# EAGLE design nixie board (EAGLE 9.5.1)
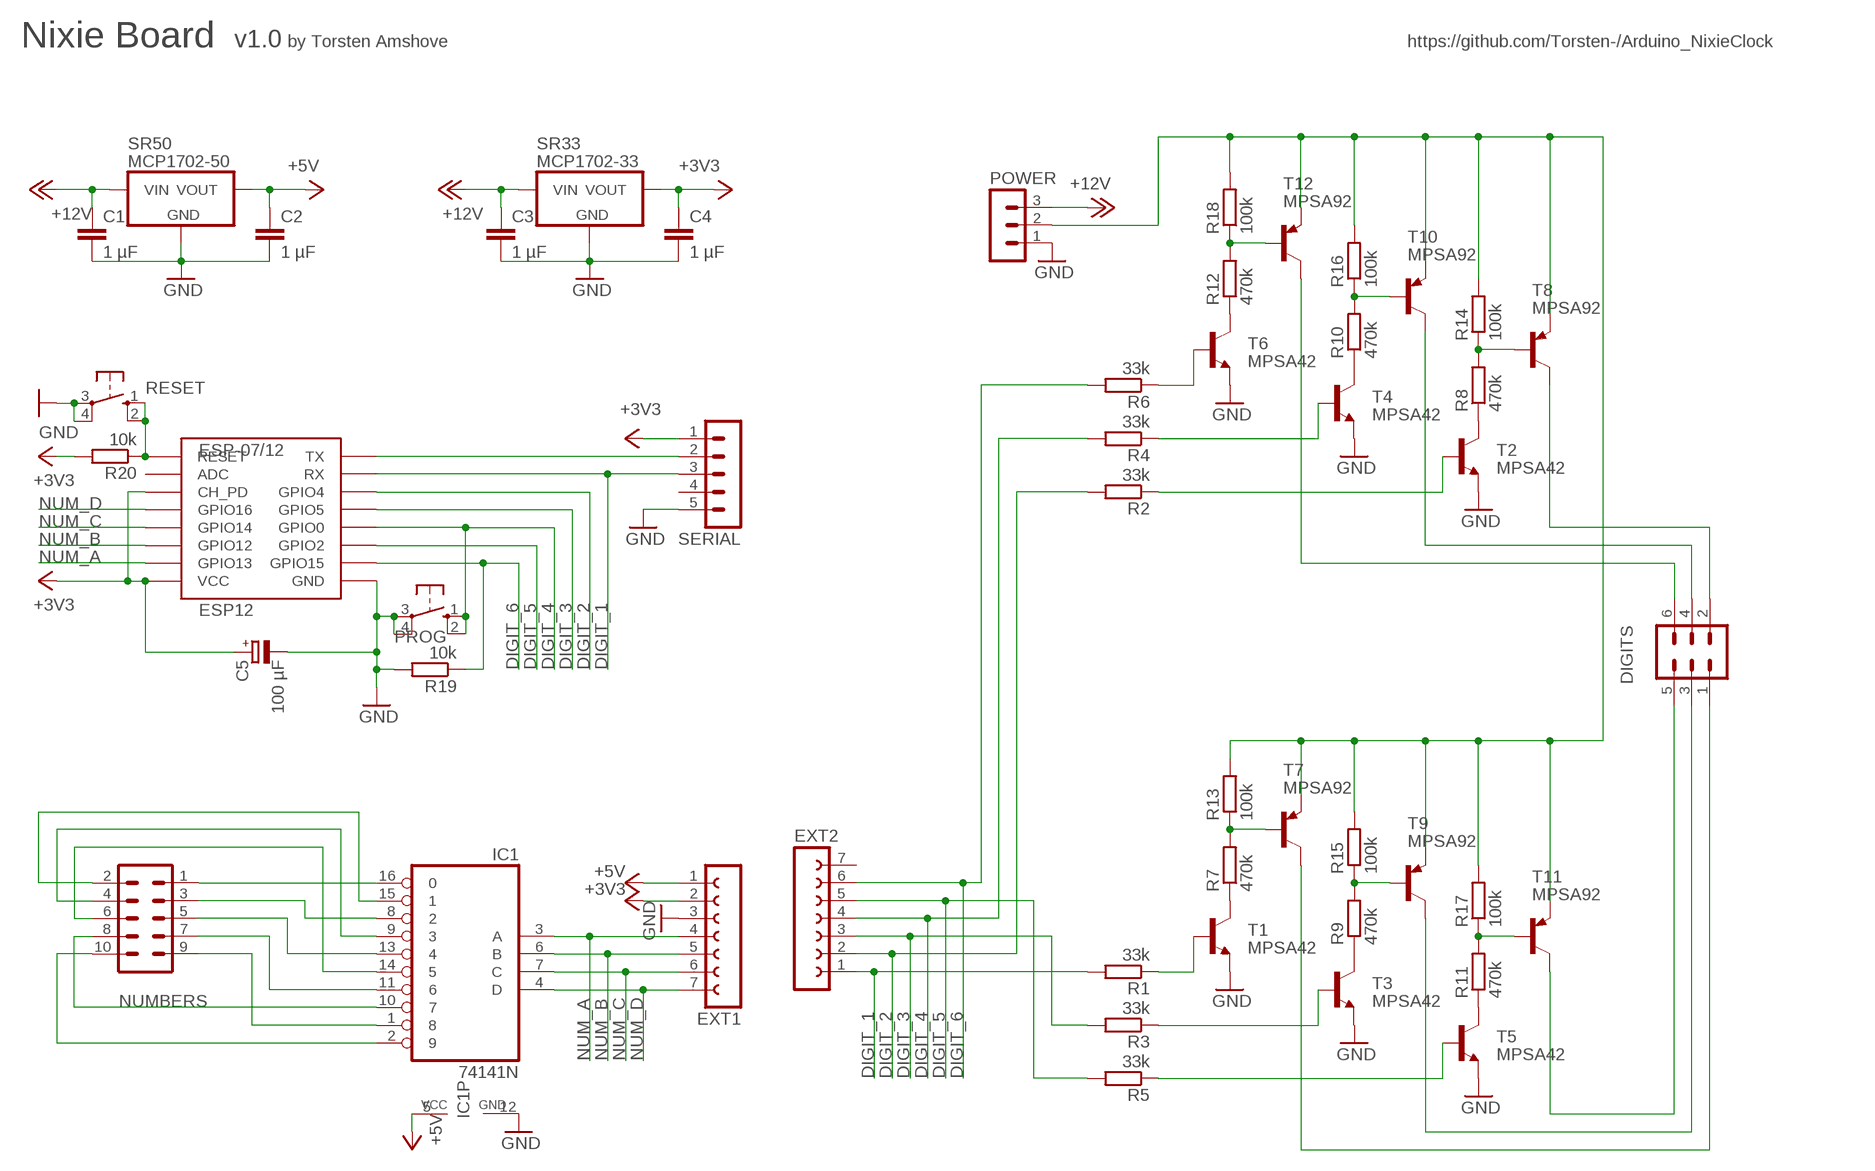
[diagram p0: schematic, sheet 1]

## Parts
C1  1 µF  C5/4.5  [C5B4.5]
C2  1 µF  C5/4.5  [C5B4.5]
C3  1 µF  C5/4.5  [C5B4.5]
C4  1 µF  C5/4.5  [C5B4.5]
C5  100 µF  CPOL-EUE2.5-6  [E2,5-6]
DIGITS  MA03-2  [MA03-2]
ESP-07/12  ESP12  [ESP12]
EXT1  FE07-1  [FE07]
EXT2  FE07-1  [FE07]
IC1  74141N  [DIL16]
NUMBERS  MA05-2  [MA05-2]
POWER  MA03-1  [MA03-1]
PROG  10-XX  [B3F-10XX]
R1  33k  R-EU_0204/7  [0204/7]
R2  33k  R-EU_0204/7  [0204/7]
R3  33k  R-EU_0204/7  [0204/7]
R4  33k  R-EU_0204/7  [0204/7]
R5  33k  R-EU_0204/7  [0204/7]
R6  33k  R-EU_0204/7  [0204/7]
R7  470k  R-EU_0204/7  [0204/7]
R8  470k  R-EU_0204/7  [0204/7]
R9  470k  R-EU_0204/7  [0204/7]
R10  470k  R-EU_0204/7  [0204/7]
R11  470k  R-EU_0204/7  [0204/7]
R12  470k  R-EU_0204/7  [0204/7]
R13  100k  R-EU_0207/2V  [0207/2V]
R14  100k  R-EU_0207/2V  [0207/2V]
R15  100k  R-EU_0207/2V  [0207/2V]
R16  100k  R-EU_0207/2V  [0207/2V]
R17  100k  R-EU_0207/2V  [0207/2V]
R18  100k  R-EU_0207/2V  [0207/2V]
R19  10k  R-EU_0204/7  [0204/7]
R20  10k  R-EU_0204/7  [0204/7]
RESET  10-XX  [B3F-10XX]
SERIAL  MA05-1  [MA05-1]
SR33  MCP1702-33  MCP1702  [TO-92]
SR50  MCP1702-50  MCP1702  [TO-92]
T1  MPSA42  MPSA42-NPN-TO92-EBC  [TO92-EBC]
T2  MPSA42  MPSA42-NPN-TO92-EBC  [TO92-EBC]
T3  MPSA42  MPSA42-NPN-TO92-EBC  [TO92-EBC]
T4  MPSA42  MPSA42-NPN-TO92-EBC  [TO92-EBC]
T5  MPSA42  MPSA42-NPN-TO92-EBC  [TO92-EBC]
T6  MPSA42  MPSA42-NPN-TO92-EBC  [TO92-EBC]
T7  MPSA92  MPSA92-PNP-TO92-EBC  [TO92-EBC]
T8  MPSA92  MPSA92-PNP-TO92-EBC  [TO92-EBC]
T9  MPSA92  MPSA92-PNP-TO92-EBC  [TO92-EBC]
T10  MPSA92  MPSA92-PNP-TO92-EBC  [TO92-EBC]
T11  MPSA92  MPSA92-PNP-TO92-EBC  [TO92-EBC]
T12  MPSA92  MPSA92-PNP-TO92-EBC  [TO92-EBC]

## Nets
+3V3: C4.1 C5.+ ESP-07/12.CH_PD ESP-07/12.VCC EXT1.2 R20.2 SERIAL.1 SR33.3(VOUT)
+5V: C2.1 EXT1.1 IC1.5(VCC) SR50.3(VOUT)
+12V: C1.1 C3.1 POWER.3 SR33.2(VIN) SR50.2(VIN)
DIGIT_1: ESP-07/12.RX EXT2.1 R1.2 SERIAL.3
DIGIT_2: ESP-07/12.GPIO4 EXT2.2 R2.2
DIGIT_3: ESP-07/12.GPIO5 EXT2.3 R3.2
DIGIT_4: ESP-07/12.GPIO0 EXT2.4 PROG.1(S) PROG.2(S1) R4.2
DIGIT_5: ESP-07/12.GPIO2 EXT2.5 R5.2
DIGIT_6: ESP-07/12.GPIO15 EXT2.6 R6.2 R19.1
GND: C1.2 C2.2 C3.2 C4.2 C5.- ESP-07/12.GND EXT1.3 IC1.12(GND) POWER.1 PROG.3(P) PROG.4(P1) R19.2 RESET.3(P) RESET.4(P1) SERIAL.5 SR33.1(GND) SR50.1(GND) T1.E T2.E T3.E T4.E T5.E T6.E
N$1: ESP-07/12.TX SERIAL.2
N$2: IC1.16 NUMBERS.1
N$3: IC1.15 NUMBERS.2
N$4: POWER.2 R13.2 R14.2 R15.2 R16.2 R17.2 R18.2 T7.E T8.E T9.E T10.E T11.E T12.E
N$5: R6.1 T6.B
N$6: R4.1 T4.B
N$7: R12.1 T6.C
N$8: R12.2 R18.1 T12.B
N$9: R2.1 T2.B
N$10: IC1.9 NUMBERS.4
N$11: IC1.14 NUMBERS.6
N$12: R10.1 T4.C
N$13: R10.2 R16.1 T10.B
N$14: IC1.8 NUMBERS.3
N$15: DIGITS.6 T12.C
N$16: R7.1 T1.C
N$17: R8.1 T2.C
N$18: R8.2 R14.1 T8.B
N$19: R7.2 R13.1 T7.B
N$20: DIGITS.4 T10.C
N$21: DIGITS.2 T8.C
N$22: R9.1 T3.C
N$23: R9.2 R15.1 T9.B
N$24: IC1.13 NUMBERS.5
N$25: R11.1 T5.C
N$26: R11.2 R17.1 T11.B
N$27: IC1.11 NUMBERS.7
N$28: IC1.1 NUMBERS.9
N$29: IC1.10 NUMBERS.8
N$30: R1.1 T1.B
N$31: R3.1 T3.B
N$32: R5.1 T5.B
N$33: IC1.2 NUMBERS.10
N$34: ESP-07/12.RESET R20.1 RESET.1(S) RESET.2(S1)
N$69: DIGITS.5 T11.C
N$70: DIGITS.3 T9.C
N$71: DIGITS.1 T7.C
NUM_A: ESP-07/12.GPIO13 EXT1.4 IC1.3(A)
NUM_B: ESP-07/12.GPIO12 EXT1.5 IC1.6(B)
NUM_C: ESP-07/12.GPIO14 EXT1.6 IC1.7(C)
NUM_D: ESP-07/12.GPIO16 EXT1.7 IC1.4(D)
Unconnected: ESP-07/12.ADC EXT2.7 SERIAL.4

## Notes on the sheet
- Nixie Board | v1.0 | by Torsten Amshove | https://github.com/Torsten-/Arduino_NixieClock

## Library data of the parts
C1-C4 = capacitor-wima:C: CAPACITOR naming: grid - package width
C5 = rcl:CPOL-EU: POLARIZED CAPACITOR, European symbol; SPICEPREFIX: C
DIGITS = con-lstb:MA03-2: PIN HEADER; OC_FARNELL: unknown; OC_NEWARK: unknown
ESP-07/12 = esp8266modules:ESP12: ESP8266 Wifi module 12
EXT1 EXT2 = con-lsta:FE07-1: FEMALE HEADER; OC_FARNELL: unknown; OC_NEWARK: unknown
IC1 = 74xx-eu:74*141: BCD to decimal DECODER/DRIVER
NUMBERS = con-lstb:MA05-2: PIN HEADER; OC_FARNELL: unknown; OC_NEWARK: unknown
POWER = con-lstb:MA03-1: PIN HEADER; OC_FARNELL: unknown; OC_NEWARK: unknown
PROG RESET = switch-omron:10-XX: OMRON SWITCH; MPN: B3F-1000; OC_FARNELL: 176432; OC_NEWARK: 36M3542
R1-R20 = resistor:R-EU_: RESISTOR, European symbol
SERIAL = con-lstb:MA05-1: PIN HEADER; OC_FARNELL: unknown; OC_NEWARK: unknown
SR33 SR50 = SteveMarple:MCP1702: Microchip MCP1702 250mA low quiescent current (2uA) LDO voltage regulator.
T1-T6 = transistor:*-NPN-: NPN Transistror BF959 corrected 2008.03.06
T7-T12 = transistor:*-PNP-: PNP Transistror

## Board
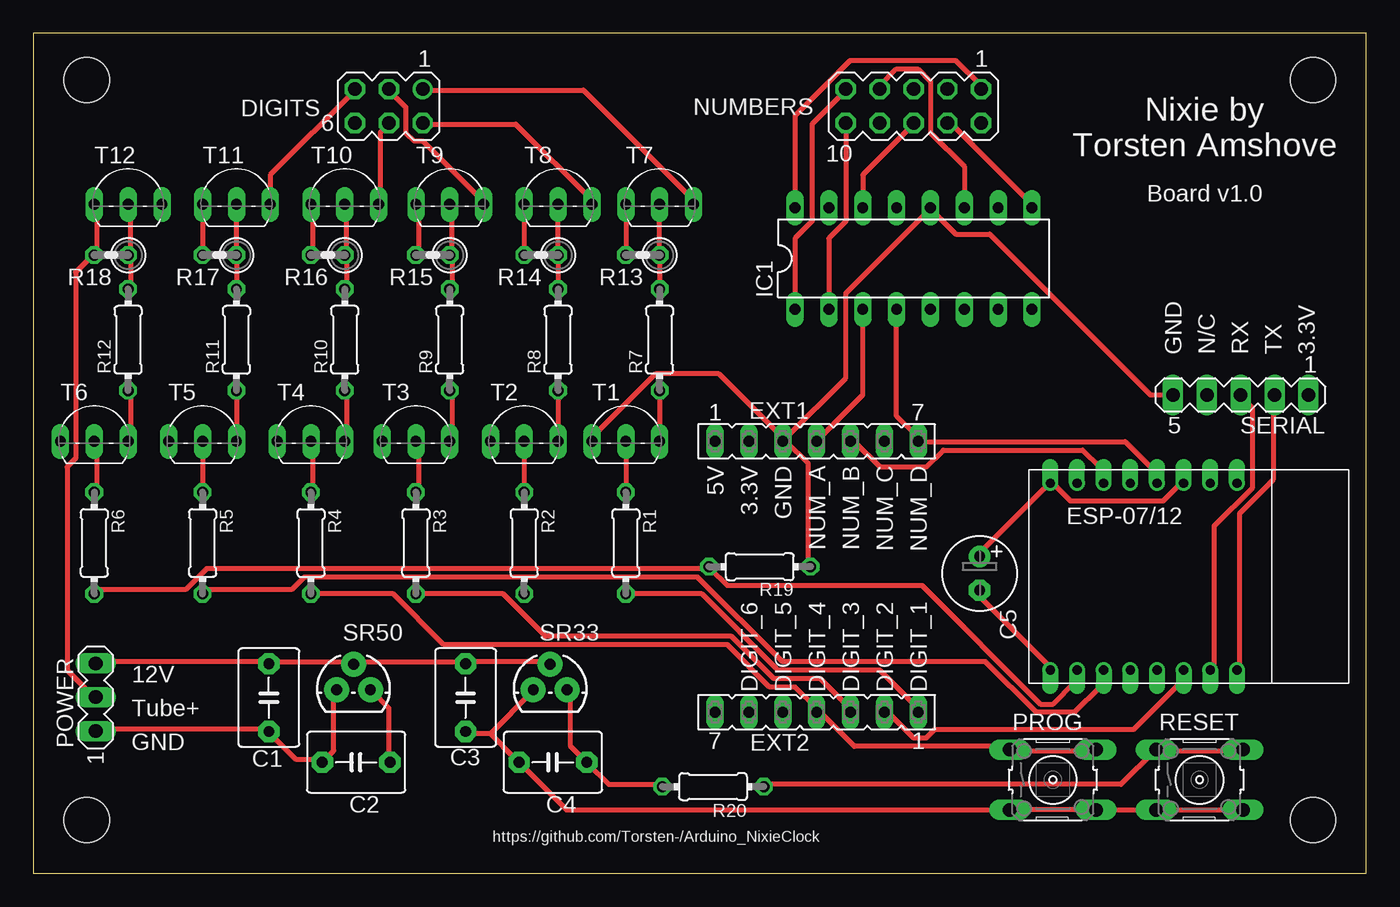
[diagram p1: board, top side]
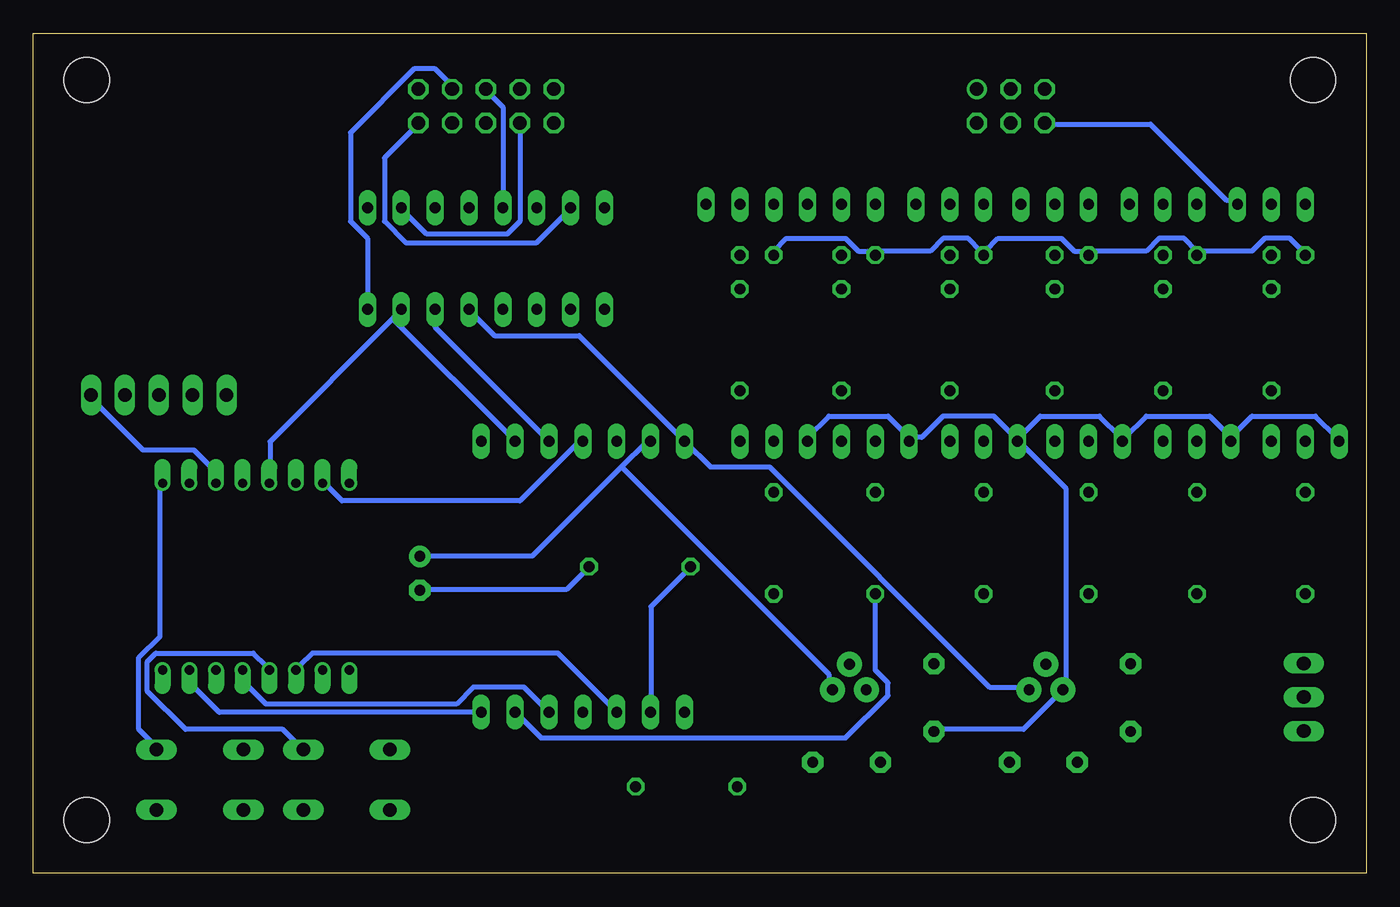
[diagram p2: board, bottom side, seen from below]

Size 100 x 63 mm. Coordinates in mm from the lower left corner, seen from the top.
Outline: 0,0 100,0 100,63 0,63 0,0
Copper layers (1*16): Top 0.035mm / dielectric 1.5mm / Bottom 0.035mm
Design rules "default *": minimum track width 15mil, minimum drill 24mil, track to track 10mil, track to pad 10mil, pad to pad 8mil, via to via 8mil, smd to smd 8mil, copper to edge 40mil, drill to drill 8mil, minimum pad ring 10mil, minimum via ring 8mil, stop-mask expansion 4mil, vias tented up to drill 0mil, thermal gap 10mil
Holes 3.4 mm at 4,4 4,59.5 96,4 96,59.5

### Footprints (pad centres in the part's own frame; a part is rotated, then mirrored left to right if it is on the bottom)
C5B4.5 = drill 0.813 pad 1.6 octagon: 1 -2.54,0; 2 2.54,0
E2,5-6 = drill 0.813 pad 1.6: + -1.27,0 | drill 0.813 pad 1.6 octagon: - 1.27,0
MA03-2 = drill 1.016: 1 -2.54,-1.27 | drill 1.016 octagon: 2 -2.54,1.27; 3 0,-1.27; 4 0,1.27; 5 2.54,-1.27; 6 2.54,1.27
ESP12 = drill 0.7 offset: ADC -7.1,3.8; CH_PD -7.1,1.8; GND 6.9,-8.2; GPIO0 6.9,-2.2; GPIO2 6.9,-4.2; GPIO4 6.9,1.8; GPIO5 6.9,-0.2; GPIO12 -7.1,-4.2; GPIO13 -7.1,-6.2; GPIO14 -7.1,-2.2; GPIO15 6.9,-6.2; GPIO16 -7.1,-0.2; RESET -7.1,5.8; RX 6.9,3.8; TX 6.9,5.8; VCC -7.1,-8.2
FE07 = drill 0.813 long: 1 -7.62,0; 2 -5.08,0; 3 -2.54,0; 4 0,0; 5 2.54,0; 6 5.08,0; 7 7.62,0
DIL16 = drill 0.813 long: 1 -8.89,-3.81; 2 -6.35,-3.81; 3 -3.81,-3.81; 4 -1.27,-3.81; 5 1.27,-3.81; 6 3.81,-3.81; 7 6.35,-3.81; 8 8.89,-3.81; 9 8.89,3.81; 10 6.35,3.81; 11 3.81,3.81; 12 1.27,3.81; 13 -1.27,3.81; 14 -3.81,3.81; 15 -6.35,3.81; 16 -8.89,3.81
MA05-2 = drill 1.016 octagon: 1 -5.08,-1.27; 2 -5.08,1.27; 3 -2.54,-1.27; 4 -2.54,1.27; 5 0,-1.27; 6 0,1.27; 7 2.54,-1.27; 8 2.54,1.27; 9 5.08,-1.27; 10 5.08,1.27
MA03-1 = drill 1.016 long: 1 -2.54,0; 2 0,0; 3 2.54,0
B3F-10XX = drill 1.016 long: 1 -3.251,2.261; 2 3.251,2.261; 3 -3.251,-2.261; 4 3.251,-2.261
0204/7 = drill 0.813 octagon: 1 -3.81,0; 2 3.81,0
0207/2V = drill 0.813 octagon: 1 -1.27,0; 2 1.27,0
MA05-1 = drill 1.016 long: 1 -5.08,0; 2 -2.54,0; 3 0,0; 4 2.54,0; 5 5.08,0
TO-92 = drill 0.813 pad 1.88: 1 -1.27,0; 2 0,1.905; 3 1.27,0
TO92-EBC = drill 0.813 long: B 0,-1.27; C 2.54,-1.27; E -2.54,-1.27

### Placement (x,y rotation side)
C1  17.67,13.18 270 top
C2  24.22,8.33 180 top
C3  32.43,13.18 270 top
C4  38.98,8.33 180 top
C5  71,22.5 270 top
DIGITS  26.67,57.54 180 top
ESP-07/12  84.5,22.16 270 top
EXT1  58.77,32.41 0 top
EXT2  58.77,12.09 180 top
IC1  66.04,46.11 0 top
NUMBERS  66.04,57.54 180 top
POWER  4.68,13.21 90 top
PROG  76.49,7.01 0 top
R1  44.45,24.77 270 top
R2  36.83,24.77 270 top
R3  28.7,24.77 270 top
R4  20.83,24.77 270 top
R5  12.7,24.77 270 top
R6  4.57,24.77 270 top
R7  46.99,40.01 90 top
R8  39.37,40.01 90 top
R9  31.24,40.01 90 top
R10  23.37,40.01 90 top
R11  15.24,40.01 90 top
R12  7.11,40.01 90 top
R13  45.72,46.36 180 top
R14  38.1,46.36 180 top
R15  29.97,46.36 180 top
R16  22.1,46.36 180 top
R17  13.97,46.36 180 top
R18  5.84,46.36 180 top
R19  54.5,23 0 top
R20  51,6.5 180 top
RESET  87.5,7.01 0 top
SERIAL  90.59,35.87 180 top
SR33  38.78,13.78 0 top
SR50  24.02,13.78 0 top
T1  44.45,33.66 0 top
T2  36.83,33.66 0 top
T3  28.7,33.66 0 top
T4  20.83,33.66 0 top
T5  12.7,33.66 0 top
T6  4.57,33.66 0 top
T7  46.99,51.44 0 top
T8  39.37,51.44 0 top
T9  31.24,51.44 0 top
T10  23.37,51.44 0 top
T11  15.24,51.44 0 top
T12  7.11,51.44 0 top

### Tracks (layer width: path | path; a pad name or v marks a point on that pad's centre or on a via)
+3V3
  Top 0.381: R20.2 46.99,6.67 43.18,6.67 41.59,8.26 C4.1 41.27,8.57 40.32,9.53 40.32,13.65 SR33.3 | C5.+ 70.8,23.81 76.2,29.21 ESP-07/12.VCC 76.52,29.21 77.79,27.94 84.77,27.94 86.04,29.21 ESP-07/12.CH_PD
  Bottom 0.381: 55.88,30.48 62.55,23.81 70.8,23.81 C5.+ | 55.88,30.48 53.98,32.38 EXT1.2 | SERIAL.1 95.57,35.56 91.76,31.75 87.95,31.75 86.36,30.16 86.36,29.53 ESP-07/12.CH_PD | 55.88,30.48 40.32,14.92 40.32,13.97 SR33.3
+5V
  Top 0.381: C2.1 26.67,8.57 26.67,12.38 25.4,13.65 SR50.3
  Bottom 0.381: IC1.5 67.31,42.23 65.41,40.32 59.05,40.32 51.44,32.7 EXT1.1 51.12,32.38 49.21,30.48 44.77,30.48 28.26,13.97 25.4,13.97 SR50.3
+12V
  Top 0.381: SR33.2 38.73,15.88 32.7,15.88 C3.1 32.38,15.88 24.13,15.88 SR50.2 23.81,15.88 17.78,15.88 C1.1 17.46,15.88 4.76,15.88 POWER.3
DIGIT_1
  Top 0.381: ESP-07/12.RX 88.58,15.56 88.58,26.04 91.44,28.89 91.44,34.92 90.81,35.56 SERIAL.3 | R1.2 50.16,20.95 55.88,15.24 63.5,15.24 66.36,12.38 EXT2.1
  Bottom 0.381: ESP-07/12.RX 88.27,15.24 88.27,14.29 86.04,12.06 66.67,12.06 EXT2.1
DIGIT_2
  Top 0.381: ESP-07/12.GPIO4 86.04,15.24 86.04,14.29 82.55,10.79 67.63,10.79 66.99,10.16 66.04,10.16 64.14,12.06 EXT2.2
  Bottom 0.381: R2.2 36.83,15.24 35.88,14.29 35.88,13.34 39.05,10.16 61.91,10.16 63.82,12.06 EXT2.2
DIGIT_3
  Top 0.381: R3.2 28.89,20.95 35.24,20.95 38.42,17.78 52.39,17.78 55.56,14.61 59.05,14.61 61.28,12.38 EXT2.3
  Bottom 0.381: ESP-07/12.GPIO5 84.14,15.24 84.14,14.29 82.55,12.7 68.26,12.7 66.99,13.97 63.18,13.97 61.59,12.38 EXT2.3
DIGIT_4
  Top 0.381: R4.2 20.95,20.95 26.99,20.95 30.8,17.14 52.07,17.14 55.24,13.97 57.15,13.97 58.74,12.38 EXT2.4 59.05,12.06 61.59,9.53 73.03,9.53 PROG.1 73.34,9.21 79.69,9.21 PROG.2
  Bottom 0.381: ESP-07/12.GPIO0 82.55,15.56 83.5,16.51 90.81,16.51 91.44,15.88 91.44,13.65 88.58,10.79 81.28,10.79 80.01,9.53 PROG.2
DIGIT_5
  Top 0.381: R5.2 12.7,21.27 19.37,21.27 20.32,22.23 49.85,22.23 56.2,15.88 71.44,15.88 75.25,12.06 78.11,12.06 80.01,13.97 80.01,15.24 ESP-07/12.GPIO2
  Bottom 0.381: ESP-07/12.GPIO2 80.01,15.56 79.06,16.51 60.64,16.51 56.52,12.38 EXT2.5
DIGIT_6
  Top 0.381: ESP-07/12.GPIO15 78.11,15.24 78.11,14.29 76.52,12.7 75.56,12.7 66.67,21.59 52.07,21.59 50.8,22.86 R19.1 50.48,22.86 13.02,22.86 11.43,21.27 4.76,21.27 R6.2
  Bottom 0.381: EXT2.6 53.66,12.38 53.66,20 50.8,22.86 R19.1
GND
  Top 0.381: RESET.4 90.49,4.76 84.45,4.76 RESET.3 84.14,4.76 80.01,4.76 PROG.4 79.69,4.76 73.34,4.76 PROG.3 73.03,4.76 40.01,4.76 36.51,8.26 C4.2 36.2,8.57 34.29,10.48 | 34.29,10.48 32.7,10.48 C3.2 | 34.29,10.48 37.47,13.65 SR33.1 | POWER.1 4.76,10.79 17.46,10.79 C1.2 17.78,10.48 19.68,8.57 21.59,8.57 C2.2 21.91,8.57 22.54,9.21 22.54,13.65 SR50.1 | ESP-07/12.GND 76.2,15.56 70.8,20.95 C5.- | R19.2 58.1,23.18 58.1,30.8 56.52,32.38 EXT1.3 | 67.31,49.85 60.96,43.5 60.96,37.15 56.52,32.7 EXT1.3 | 67.31,49.85 69.22,47.94 71.75,47.94 83.82,35.88 85.41,35.88 SERIAL.5 | 67.31,49.85 IC1.12 | T1.E 41.91,32.7 46.67,37.47 51.44,37.47 56.2,32.7 EXT1.3
  Bottom 0.381: C3.2 32.38,10.79 25.72,10.79 22.86,13.65 SR50.1 22.54,13.97 22.54,28.89 26.04,32.38 T3.E | 10.16,32.7 8.57,34.29 3.81,34.29 2.22,32.7 T6.E | 34.29,32.7 35.88,34.29 40.32,34.29 41.91,32.7 T1.E | T3.E 26.04,32.7 24.45,34.29 20,34.29 18.41,32.7 T4.E 18.1,32.7 16.51,34.29 11.75,34.29 10.16,32.7 | 34.29,32.7 33.34,32.7 31.75,34.29 27.94,34.29 26.35,32.7 T3.E | 34.29,32.7 T2.E | 10.16,32.7 T5.E | C5.- 70.8,21.27 60.01,21.27 58.42,22.86 R19.2
N$1
  Top 0.381: ESP-07/12.TX 90.49,15.56 90.49,26.99 93.03,29.53 93.03,35.56 SERIAL.2
N$2
  Top 0.381: IC1.16 57.15,56.83 61.28,60.96 69.22,60.96 71.12,59.05 NUMBERS.1
N$3
  Bottom 0.381: IC1.15 59.69,49.85 62.23,47.31 72.07,47.31 73.66,48.9 73.66,53.66 71.12,56.2 NUMBERS.2
N$4
  Top 0.381: T8.E R14.2 | T7.E R13.2 | R16.2 20.95,46.67 20.95,50.16 T10.E | R15.2 28.89,46.67 28.89,50.16 T9.E | T11.E R17.2 | T12.E 4.76,50.16 4.76,46.67 R18.2 4.45,46.35 3.17,45.09 3.17,31.11 2.54,30.48 2.54,15.24 4.45,13.34 POWER.2
  Bottom 0.381: 36.83,46.67 38.1,46.67 39.05,47.62 43.5,47.62 44.45,46.67 R13.2 | 36.83,46.67 32.7,46.67 31.75,47.62 29.84,47.62 28.89,46.67 R15.2 28.57,46.67 27.62,47.62 22.86,47.62 21.91,46.67 20.95,46.67 R16.2 20.64,46.67 16.51,46.67 15.56,47.62 13.65,47.62 12.7,46.67 | 36.83,46.67 R14.2 | 12.7,46.67 8.57,46.67 7.62,47.62 5.71,47.62 4.76,46.67 R18.2 | 12.7,46.67 R17.2
N$5
  Top 0.381: R6.1 4.76,28.89 4.76,32.38 T6.B
N$6
  Top 0.381: R4.1 20.95,28.89 20.95,32.38 T4.B
N$7
  Top 0.381: T6.C 7.3,32.7 7.3,36.2 R12.1
N$8
  Top 0.381: R12.2 7.3,44.13 7.3,46.35 R18.1 7.3,46.67 7.3,50.16 T12.B
N$9
  Top 0.381: T2.B R2.1
N$10
  Top 0.381: IC1.9 74.93,50.16 68.58,56.52 NUMBERS.4
N$11
  Top 0.381: IC1.14 62.23,52.39 66.04,56.2 NUMBERS.6
N$12
  Top 0.381: T4.C 23.5,32.7 23.5,36.2 R10.1
N$13
  Top 0.381: R10.2 23.5,44.13 23.5,46.35 R16.1 23.5,46.67 23.5,50.16 T10.B
N$14
  Bottom 0.381: IC1.8 74.93,47.62 76.2,48.9 76.2,55.56 71.44,60.33 69.85,60.33 68.58,59.05 NUMBERS.3
N$15
  Bottom 0.381: T12.C 9.84,50.48 10.48,50.48 16.19,56.2 24.13,56.2 DIGITS.6
N$16
  Top 0.381: R7.1 T1.C
N$17
  Top 0.381: R8.1 T2.C
N$18
  Top 0.381: R8.2 R14.1 T8.B
N$19
  Top 0.381: R7.2 R13.1 T7.B
N$20
  Top 0.381: T10.C 26.04,50.48 26.04,55.56 26.67,56.2 DIGITS.4
N$21
  Top 0.381: T8.C 41.91,50.48 36.2,56.2 29.21,56.2 DIGITS.2
N$22
  Top 0.381: T3.C 31.43,32.7 31.43,36.2 R9.1
N$23
  Top 0.381: R9.2 31.43,44.13 31.43,46.35 R15.1 31.43,46.67 31.43,50.16 T9.B
N$24
  Bottom 0.381: IC1.13 64.77,57.47 66.04,58.74 NUMBERS.5
N$25
  Top 0.381: R11.1 T5.C
N$26
  Top 0.381: R11.2 R17.1 T11.B
N$27
  Top 0.381: IC1.11 69.85,53.02 67.31,55.56 67.31,59.37 66.36,60.33 64.77,60.33 63.5,59.05 NUMBERS.7
N$28
  Top 0.381: IC1.1 57.15,47.62 58.42,48.9 58.42,56.2 60.96,58.74 NUMBERS.9
N$29
  Bottom 0.381: NUMBERS.8 63.5,48.9 64.45,47.94 70.48,47.94 72.39,49.85 IC1.10
N$30
  Top 0.381: T1.B R1.1
N$31
  Top 0.381: R3.1 28.89,28.89 28.89,32.38 T3.B
N$32
  Top 0.381: T5.B R5.1
N$33
  Top 0.381: IC1.2 59.69,47.62 60.96,48.9 NUMBERS.10
N$34
  Top 0.381: R20.1 54.93,6.67 81.6,6.67 84.14,9.21 RESET.1 84.45,9.21 90.49,9.21 RESET.2
  Bottom 0.381: ESP-07/12.RESET 90.49,29.21 90.49,17.78 92.08,16.19 92.08,10.79 90.81,9.53 RESET.2
N$69
  Top 0.381: T11.C 17.78,52.39 24.13,58.74 DIGITS.5
N$70
  Top 0.381: T9.C 33.66,50.48 29.21,54.93 28.57,54.93 27.94,55.56 27.94,57.47 26.67,58.74 DIGITS.3
N$71
  Top 0.381: T7.C 49.53,50.48 41.27,58.74 29.21,58.74 DIGITS.1
NUM_A
  Top 0.381: IC1.3 62.23,35.88 59.05,32.7 EXT1.4
  Bottom 0.381: ESP-07/12.GPIO13 78.11,29.21 76.83,27.94 63.5,27.94 59.05,32.38 EXT1.4
NUM_B
  Top 0.381: ESP-07/12.GPIO12 80.01,29.53 80.01,30.48 78.74,31.75 68.26,31.75 66.99,30.48 63.5,30.48 61.59,32.38 EXT1.5
  Bottom 0.381: IC1.6 69.85,40.96 61.59,32.7 EXT1.5
NUM_C
  Bottom 0.381: 73.03,41.59 72.39,42.23 IC1.7 73.03,41.59 | 73.03,41.59 82.23,32.38 82.23,29.53 ESP-07/12.GPIO14 | 73.03,41.59 64.14,32.7 EXT1.6
NUM_D
  Top 0.381: ESP-07/12.GPIO16 84.14,29.53 84.14,30.16 81.92,32.38 66.67,32.38 EXT1.7 66.36,32.7 64.77,34.29 IC1.4

### Text on the board
tPlace: Nixie by / Torsten Amshove | Board v1.0 | GND | N/C | RX | TX | 3.3V | 5V | 3.3V | GND | NUM_A | NUM_B | NUM_C | NUM_D | 12V | DIGIT_6 | DIGIT_5 | DIGIT_4 | DIGIT_3 | DIGIT_2 | DIGIT_1 | Tube+ | GND | https://github.com/Torsten-/Arduino_NixieClock